# EAGLE design BR110_Roco_43889_Lichtplatine_J1_007_02_03 (EAGLE 5.10)
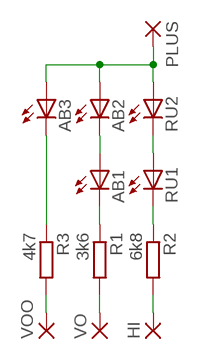
[diagram p0: schematic, sheet 1]

## Parts
AB1  LEDCHIP-LED0603  [CHIP-LED0603]
AB2  LEDCHIP-LED0603  [CHIP-LED0603]
AB3  LEDCHIP-LED0603  [CHIP-LED0603]
HI  SMD2  [SMD1,27-2,54]
PLUS  SMD2  [SMD1,27-2,54]
R1  3k6  R-EU_R0603  [R0603]
R2  6k8  R-EU_R0603  [R0603]
R3  4k7  R-EU_R0603  [R0603]
RU1  LEDCHIP-LED0603  [CHIP-LED0603]
RU2  LEDCHIP-LED0603  [CHIP-LED0603]
VO  SMD2  [SMD1,27-2,54]
VOO  SMD2  [SMD1,27-2,54]

## Nets
N$1: AB3.C R3.1
N$2: AB2.A AB3.A PLUS.1(P) RU2.A
N$3: R1.2 VO.1(P)
N$4: AB1.A AB2.C
N$5: AB1.C R1.1
N$6: RU1.A RU2.C
N$7: R2.1 RU1.C
N$8: R3.2 VOO.1(P)
N$10: HI.1(P) R2.2

## Library data of the parts
AB1-AB3 RU1 RU2 = led:LED: LED OSRAM: - CHIPLED LG R971, LG N971, LY N971, LG Q971, LY Q971, LO R971, LY R971 LH N974, LH R974 LS Q976, LO Q976, LY Q976 LO Q996 - Hyper CHIPLED LW Q18S LB Q993, LB Q99A, LB R99A - SideLED LS A670, LO A670, LY A670, LG A670, LP A670 LB A673, LV A673, LT A673, LW A673 LH A674 LY A675 LS A676, LA A676, LO A676, LY A676, LW A676 LS A679, LY A679, LG A679 - Hyper Micro SIDELED® LS Y876, LA Y876, LO Y876, LY Y876 LT Y87S - SmartLED LW L88C, LW L88S LB L89C, LB L89S, LG L890 LS L89K, LO L89K, LY L89K LS L896, LA L896, LO L896, LY L896 - TOPLED LS T670, LO T670, LY T670, LG T670, LP T670 LSG T670, LSP T670, LSY T670, LOP T670, LYG T670 LG T671, LOG T671, LSG T671 LB T673, LV T673, LT T673, LW T673 LH T674 LS T676, LA T676, LO T676, LY T676, LB T676, LH T676, LSB T676, LW T676 LB T67C, LV T67C, LT T67C, LS T67K, LO T67K, LY T67K, LW E67C LS E67B, LA E67B, LO E67B, LY E67B, LB E67C, LV E67C, LT E67C LW T67C LS T679, LY T679, LG T679 LS T770, LO T770, LY T770, LG T770, LP T770 LB T773, LV T773, LT T773, LW T773 LH T774 LS E675, LA E675, LY E675, LS T675 LS T776, LA T776, LO T776, LY T776, LB T776 LHGB T686 LT T68C, LB T68C - Hyper Mini TOPLED® LB M676 - Mini TOPLED Santana® LG M470 LS M47K, LO M47K, LY M47K Source: http://www.osram.convergy.de LUXEON: - LUMILED® LXK2-PW12-R00, LXK2-PW12-S00, LXK2-PW14-U00, LXK2-PW14-V00 LXK2-PM12-R00, LXK2-PM12-S00, LXK2-PM14-U00 LXK2-PE12-Q00, LXK2-PE12-R00, LXK2-PE12-S00, LXK2-PE14-T00, LXK2-PE14-U00 LXK2-PB12-K00, LXK2-PB12-L00, LXK2-PB12-M00, LXK2-PB14-N00, LXK2-PB14-P00, LXK2-PB14-Q00 LXK2-PR12-L00, LXK2-PR12-M00, LXK2-PR14-Q00, LXK2-PR14-R00 LXK2-PD12-Q00, LXK2-PD12-R00, LXK2-PD12-S00 LXK2-PH12-R00, LXK2-PH12-S00 LXK2-PL12-P00, LXK2-PL12-Q00, LXK2-PL12-R00 Source: www.luxeon.com KINGBRIGHT: KA-3528ASYC Source: www.kingbright.com
HI PLUS VO VOO = wirepad:SMD2: SMD PAD
R1-R3 = rcl:R-EU_: RESISTOR, European symbol

## Board
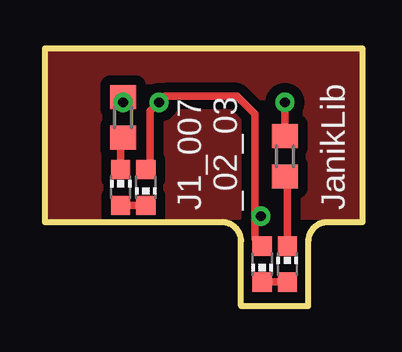
[diagram p1: board, top side]
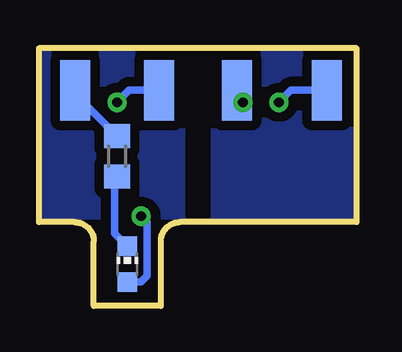
[diagram p2: board, bottom side, seen from below]

No outline drawn. Coordinates in mm, seen from the top.
Copper layers (1*16): Top 0.035mm / dielectric 1.5mm / Bottom 0.035mm
Design rules "default *": minimum track width 7mil, minimum drill 0.4mm, track to track 8mil, track to pad 8mil, pad to pad 8mil, via to via 8mil, smd to smd 8mil, copper to edge 40mil, drill to drill 8mil, minimum pad ring 10mil, minimum via ring 8mil, stop-mask expansion 4mil, vias tented up to drill 0mil, thermal gap 10mil
tKeepout: area 5.1,3.5 to 8.1,7.6; area 0,3.5 to 2.1,9.2; area 11.1,3.5 to 13.2,7.6
bKeepout: area 6.1,3.5 to 7.1,10.8
bRestrict: 1 lines
Milling: 10 lines

### Footprints (pad centres in the part's own frame; a part is rotated, then mirrored left to right if it is on the bottom)
CHIP-LED0603 = smd 0.8 x 0.8: A 0,-0.75; C 0,0.75
SMD1,27-2,54 = smd 1.27 x 2.54: 1 0,0
R0603 = smd 1 x 1.1: 1 -0.85,0; 2 0.85,0

### Placement (x,y rotation side)
AB1  10.1,1.75 0 top
AB2  9.05,1.75 180 top
AB3  9.57,1.75 0 bottom
HI  1.25,9 180 bottom
PLUS  5,9 0 bottom
R1  10,6.25 90 top
R2  3.25,7.88 90 top
R3  10,6.25 90 bottom
RU1  3.15,4.95 0 top
RU2  4.2,4.95 180 top
VO  8.25,9 0 bottom
VOO  11.75,9 0 bottom

### Tracks (layer width: path | path; a pad name or v marks a point on that pad's centre or on a via)
N$1
  Bottom 0.305: AB3.C 10.1,3.02 10.1,5.3 R3.1
N$2  (via drill 0.4)
  Top 0.305: AB2.A 8.75,2.8 8.75,3.75 | 8.75,3.75 8.75,8 8,8.75 5,8.75 v4.75,8.5 4.38,8.12 4.38,6 RU2.A | 8.75,3.75 v9,3.75
  Bottom 0.305: AB3.A 9,1 8.75,1.25 8.75,3.5 v9,3.75 | PLUS.1 5,8.75 v4.75,8.5
N$3  (via drill 0.4)
  Top 0.305: R1.2 v10,8.5
  Bottom 0.305: VO.1 9.5,9 v10,8.5
N$4
  Top 0.305: AB1.A AB2.C
N$5
  Top 0.305: AB1.C 10.1,5.3 R1.1
N$6
  Top 0.305: RU1.A RU2.C
N$7
  Top 0.305: RU1.C 3.15,6.92 R2.1
N$8
  Bottom 0.305: R3.2 11.75,8.85 VOO.1
N$10  (via drill 0.4)
  Top 0.305: v3.25,8.5 R2.2
  Bottom 0.305: HI.1 2.75,9 v3.25,8.5
N$11
  pour Bottom (isolate 0.406): 0.25,3.75 0.25,10.5 13,10.5 13,3.75
  pour Top (isolate 0.406): 0.25,3.75 0.25,10.5 13,10.5 13,3.75

### Text on the board
tNames: J1_007 | _02_03 | JanikLib
tStop: design by Janik Merz | Roco 43889 | BR110
bStop: R | + | W | W | u | o
Document: 0,5mm optimal